# EAGLE design traffic_lights (EAGLE 7.2.0)
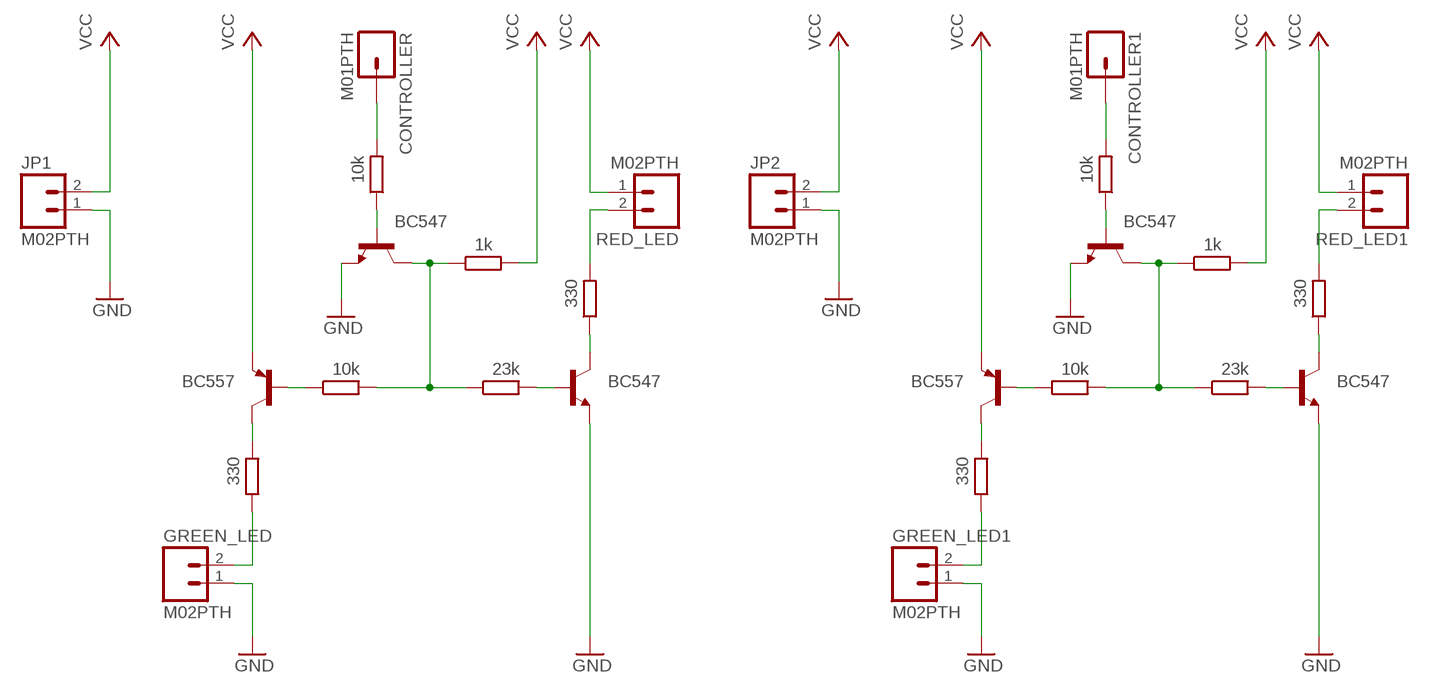
[diagram p0: schematic, sheet 1]

## Parts
CONTROLLER  M01PTH  [1X01]
CONTROLLER1  M01PTH  [1X01]
GREEN_LED  M02PTH  [1X02]
GREEN_LED1  M02PTH  [1X02]
JP1  M02PTH  [1X02]
JP2  M02PTH  [1X02]
Q1  BC557  [TO92]
Q2  BC557  [TO92]
R1  10k  R-EU_0207/10  [0207/10]
R2  10k  R-EU_0207/10  [0207/10]
R3  23k  R-EU_0207/10  [0207/10]
R4  23k  R-EU_0207/10  [0207/10]
R5  10k  R-EU_0207/10  [0207/10]
R6  1k  R-EU_0207/10  [0207/10]
R7  330  R-EU_0207/10  [0207/10]
R8  10k  R-EU_0207/10  [0207/10]
R9  1k  R-EU_0207/10  [0207/10]
R10  330  R-EU_0207/10  [0207/10]
R11  330  R-EU_0207/10  [0207/10]
R12  330  R-EU_0207/10  [0207/10]
RED_LED  M02PTH  [1X02]
RED_LED1  M02PTH  [1X02]
T1  BC547  [TO92]
T2  BC547  [TO92]
T3  BC547  [TO92]
T4  BC547  [TO92]

## Nets
GND: GREEN_LED1.1 GREEN_LED.1 JP1.1 JP2.1 T1.1(E) T2.1(E) T3.1(E) T4.1(E)
N$1: CONTROLLER.1 R8.2
N$2: R10.2 RED_LED.2
N$3: GREEN_LED.2 R11.1
N$4: R2.2 R3.1 R9.1 T2.3(C)
N$5: R8.1 T2.2(B)
N$6: Q1.2(B) R2.1
N$7: Q1.3(C) R11.2
N$8: R5.1 T4.2(B)
N$9: Q2.2(B) R1.1
N$10: R10.1 T1.3(C)
N$11: R3.2 T1.2(B)
N$12: Q2.3(C) R12.2
N$13: R7.1 T3.3(C)
N$14: R4.2 T3.2(B)
N$15: R1.2 R4.1 R6.1 T4.3(C)
N$16: R7.2 RED_LED1.2
N$17: GREEN_LED1.2 R12.1
N$18: CONTROLLER1.1 R5.2
VCC: JP1.2 JP2.2 Q1.1(E) Q2.1(E) R6.2 R9.2 RED_LED1.1 RED_LED.1

## Library data of the parts
CONTROLLER CONTROLLER1 = SparkFun-Connectors:M01: Header 1 Standard 1-pin 0.1" header. Use with straight break away headers (SKU : PRT-00116), right angle break away headers (PRT-00553), swiss pins (PRT-00743), machine pins (PRT-00117), and female headers (PRT-00115).
GREEN_LED GREEN_LED1 JP1 JP2 RED_LED RED_LED1 = SparkFun-Connectors:M02: Standard 2-pin 0.1" header. Use with - straight break away headers ( PRT-00116) - right angle break away headers (PRT-00553) - swiss pins (PRT-00743) - machine pins (PRT-00117) - female headers (PRT-00115) Molex polarized connector foot print use with: PRT-08233 with associated crimp pins and housings. 2.54_SCREWTERM for use with PRT-10571. 3.5mm Screw Terminal footprints for PRT-08084 5mm Screw Terminal footprints for use with PRT-08432
Q1 Q2 = transistor-pnp:BC557: PNP Transistor
R1-R12 = resistor:R-EU_: RESISTOR, European symbol
T1-T4 = transistor:BC547: NPN TRANSISTOR

## Net classes
0 default: width 0.381 mm

## Board
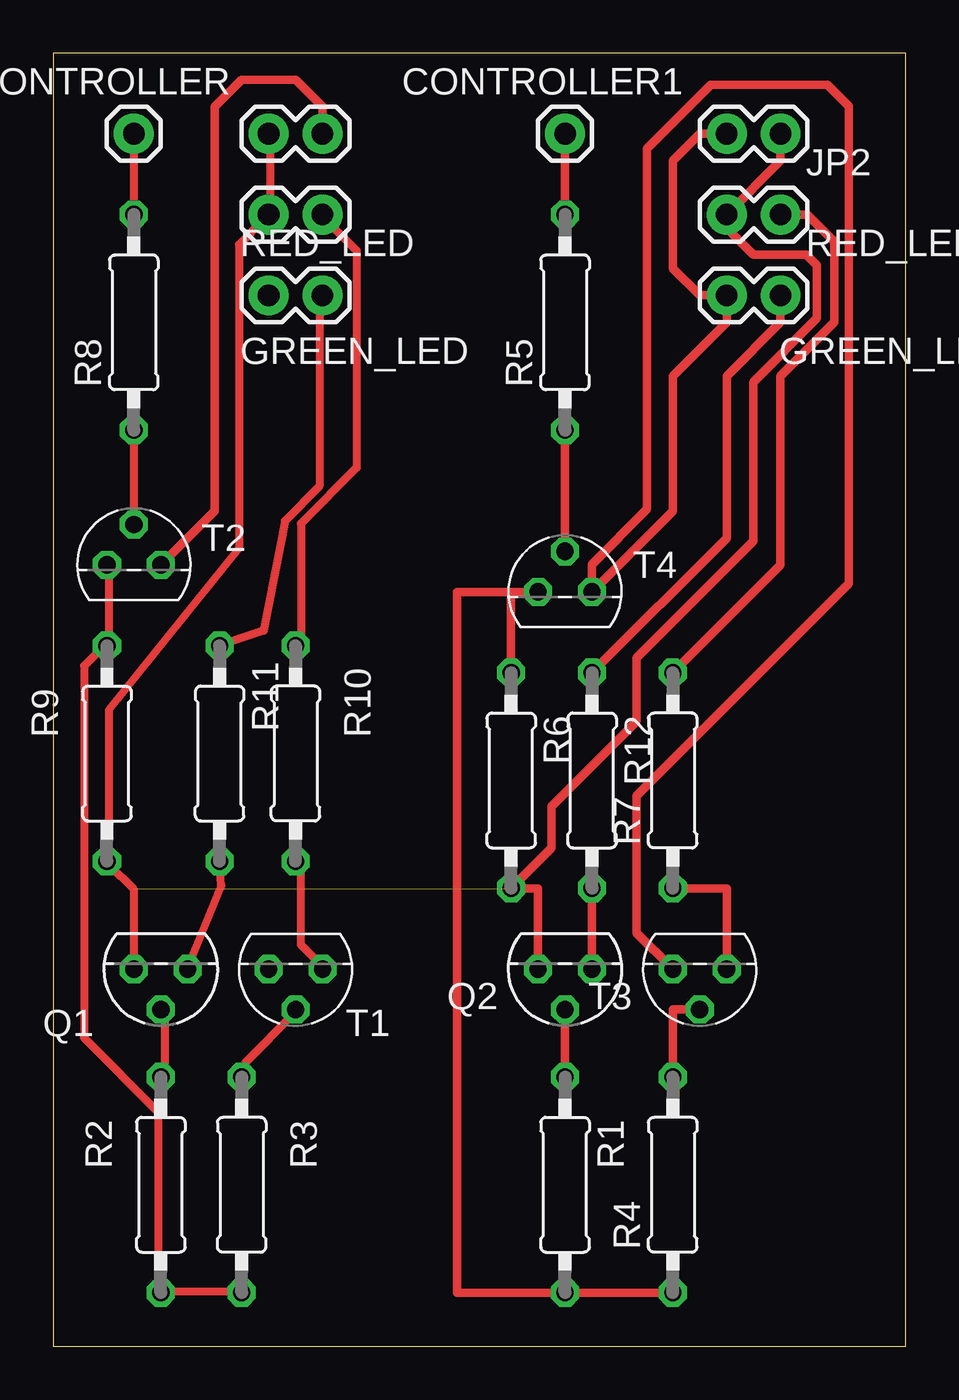
[diagram p1: board, top side]
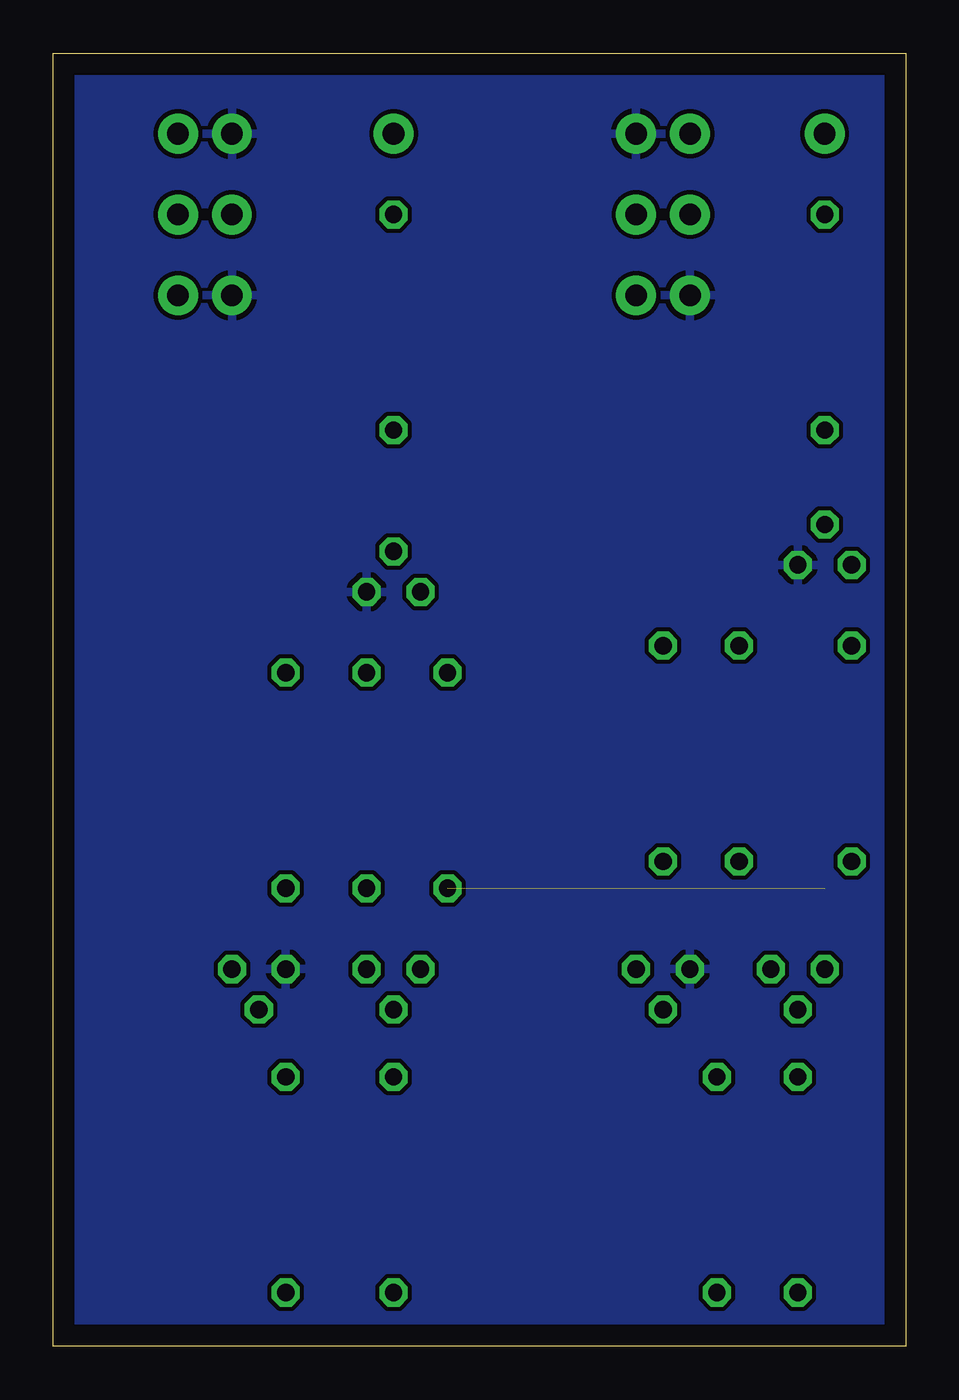
[diagram p2: board, bottom side, seen from below]

Size 40.18 x 60.95 mm. Coordinates in mm from the lower left corner, seen from the top.
Outline: 0,0 40.18,0 40.18,60.95 0,60.95 0,0
Copper layers (1*16): Top 0.035mm / dielectric 1.5mm / Bottom 0.035mm
Design rules "default": minimum track width 10mil, minimum drill 24mil, track to track 8mil, track to pad 8mil, pad to pad 8mil, via to via 8mil, smd to smd 8mil, copper to edge 40mil, drill to drill 8mil, minimum pad ring 10mil, minimum via ring 8mil, stop-mask expansion 4mil, vias tented up to drill 0mil, thermal gap 10mil

### Footprints (pad centres in the part's own frame; a part is rotated, then mirrored left to right if it is on the bottom)
1X01 = drill 1.016 pad 1.88: 1 0,0
1X02 = drill 1.016 pad 1.88: 1 0,0; 2 2.54,0
TO92 = drill 0.813 octagon: 1 1.27,0; 2 0,1.905; 3 -1.27,0
0207/10 = drill 0.813 octagon: 1 -5.08,0; 2 5.08,0

### Placement (x,y rotation side)
CONTROLLER  3.81,57.15 0 top
CONTROLLER1  24.13,57.15 0 top
GREEN_LED  10.16,49.53 0 top
GREEN_LED1  31.75,49.53 0 top
JP1  12.7,57.15 180 top
JP2  31.75,57.15 0 top
Q1  5.08,17.78 180 top
Q2  24.13,17.78 180 top
R1  24.13,7.62 270 top
R2  5.08,7.62 270 top
R3  8.89,7.62 90 top
R4  29.21,7.62 90 top
R5  24.13,48.26 90 top
R6  21.59,26.67 270 top
R7  29.21,26.67 90 top
R8  3.81,48.26 90 top
R9  2.54,27.94 270 top
R10  11.43,27.94 90 top
R11  7.85,27.94 270 top
R12  25.4,26.67 270 top
RED_LED  10.16,53.34 0 top
RED_LED1  31.75,53.34 0 top
T1  11.43,17.78 180 top
T2  3.81,36.83 0 top
T3  30.48,17.78 180 top
T4  24.13,35.56 0 top

### Tracks (layer width: path | path; a pad name or v marks a point on that pad's centre or on a via)
GND
  Top 0.406: JP1.1 12.7,58.42 11.43,59.69 8.89,59.69 7.62,58.42 7.62,39.37 T2.1 | JP2.1 30.48,57.15 29.21,55.88 29.21,50.8 30.48,49.53 GREEN_LED1.1 31.75,48.26 29.21,45.72 29.21,39.37 T4.1 25.4,36.85 28,39.45 28,56.45 31,59.45 36.5,59.45 37.5,58.45 37.5,35.95 27.5,25.95 27.5,19.49 T3.1
  pour Bottom: -1.27,62.23 42.78,62.23 42.78,-1.27 -1.27,-1.27
N$1
  Top 0.381: R8.2 3.8,53.39 3.8,56.9 CONTROLLER.1
N$2
  Top 0.381: R10.2 11.68,33.24 11.68,38.79 14.31,41.42 14.31,51.64 12.85,53.1 RED_LED.2
N$3
  Top 0.381: R11.1 9.93,33.74 10.93,38.9 12.56,40.54 12.56,49.3 GREEN_LED.2
N$4
  Top 0.381: R3.1 8.76,2.56 5.26,2.56 R2.2 4.97,2.56 4.97,11.04 1.46,14.54 1.46,32.07 2.34,32.94 R9.1 2.63,33.24 2.63,36.74 T2.3
N$5
  Top 0.381: T2.2 3.8,38.79 3.8,43.17 R8.1
N$6
  Top 0.381: R2.1 5.26,12.79 5.26,15.71 Q1.2
N$7
  Top 0.381: Q1.3 6.43,18.05 7.93,21.72 R11.2
N$8
  Top 0.406: R5.1 T4.2
N$9
  Top 0.406: Q2.2 R1.1
N$10
  Top 0.381: R10.1 11.68,22.72 11.68,18.92 12.56,18.05 T1.3
N$11
  Top 0.381: R3.2 9.05,12.79 9.05,13.37 11.39,15.71 T1.2
N$12
  Top 0.406: R12.2 Q2.3
N$13
  Top 0.406: R7.1 31.75,21.59 T3.3
N$14
  Top 0.406: T3.2 29.21,15.87 R4.2
N$15
  Top 0.406: R6.1 21.59,35.56 T4.3 19.05,35.56 19.05,2.54 R1.2 R4.1
N$16
  Top 0.406: RED_LED1.2 35.56,53.34 36.83,52.07 36.83,48.26 34.29,45.72 34.29,36.83 R7.2
N$17
  Top 0.406: GREEN_LED1.2 34.29,48.26 31.75,45.72 31.75,38.1 R12.1
N$18
  Top 0.406: CONTROLLER1.1 R5.2
VCC  (1 unrouted)
  Top 0.381: Q1.1 3.8,18.05 3.8,21.55 2.63,22.72 R9.2 2.63,23.01 2.63,29.98 8.76,37.62 8.76,51.93 9.93,53.1 RED_LED.1 10.22,53.39 10.22,56.9 JP1.2
  Top 0.406: Q2.1 22.86,21.59 R6.2 23.5,23.5 23.5,25.45 27.5,29.45 27.5,32.45 33,37.95 33,45.45 36,48.45 36,50.95 35.5,51.45 33,51.45 31.75,52.7 RED_LED1.1 34.29,55.88 JP2.2